# EAGLE schematic LockBox_ver1 (EAGLE 7.7.0)
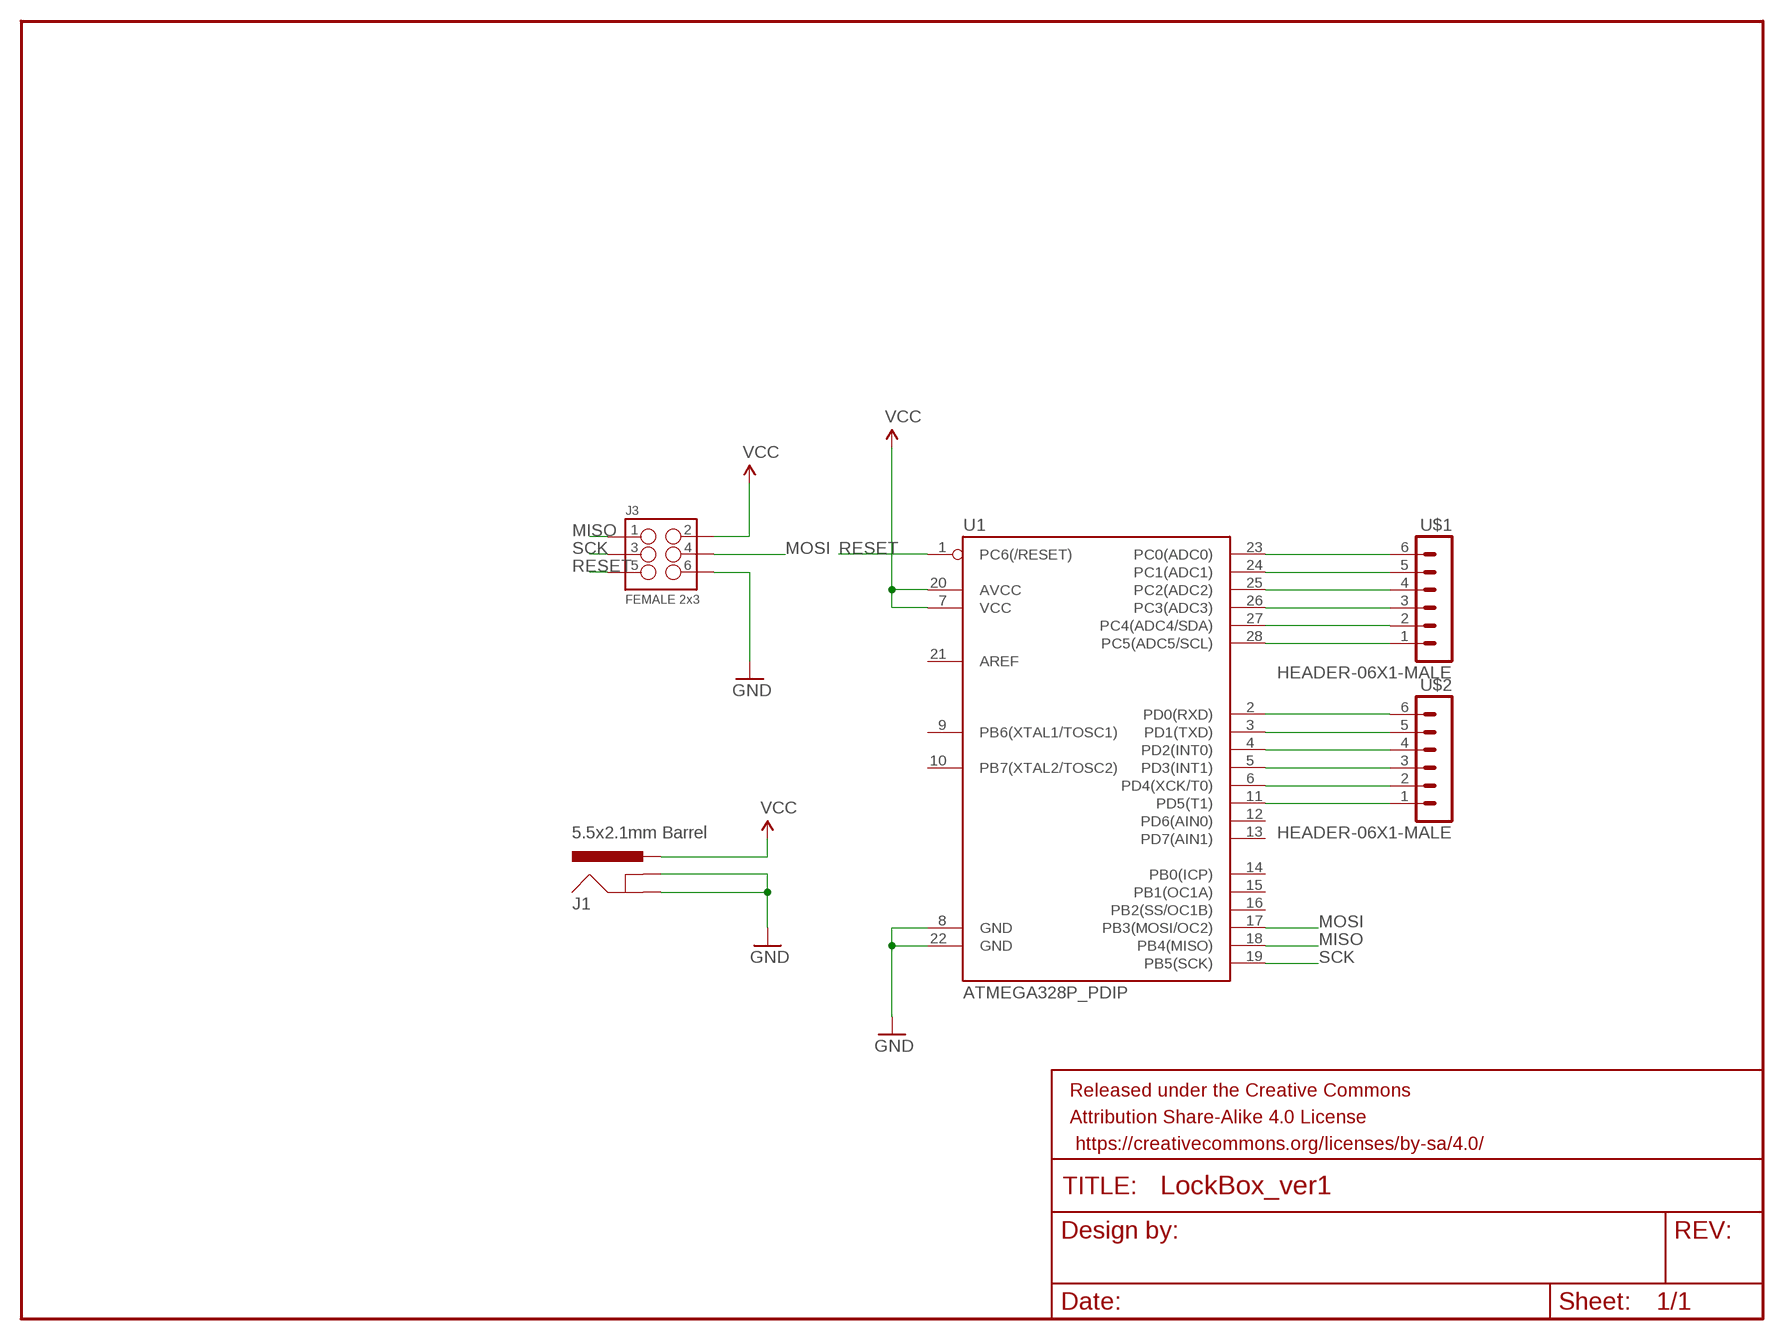
[diagram p0: schematic, sheet 1]

## Parts
FRAME1  FRAME-LETTER  [CREATIVE_COMMONS]
J1  5.5x2.1mm Barrel  POWER_JACKSMD  [POWER_JACK_SMD]
J3  FEMALE 2x3  M03X2FEMALE  [2X3]
U1  ATMEGA328P_PDIP  [DIL28-3]
U$1  HEADER-06X1-MALE  [06X1-PTH]
U$2  HEADER-06X1-MALE  [06X1-PTH]

## Nets
GND: J1.GND(GNDBREAK) J1.P$4(GND) J3.6 U1.8(GND) U1.22(GND)
MISO: J3.1 U1.18(PB4(MISO))
MOSI: J3.4 U1.17(PB3(MOSI/OC2))
N$1: U1.23(PC0(ADC0)) U$1.6
N$2: U1.24(PC1(ADC1)) U$1.5
N$3: U1.25(PC2(ADC2)) U$1.4
N$4: U1.26(PC3(ADC3)) U$1.3
N$5: U1.27(PC4(ADC4/SDA)) U$1.2
N$6: U1.28(PC5(ADC5/SCL)) U$1.1
N$7: U1.2(PD0(RXD)) U$2.6
N$8: U1.3(PD1(TXD)) U$2.5
N$9: U1.4(PD2(INT0)) U$2.4
N$10: U1.5(PD3(INT1)) U$2.3
N$11: U1.6(PD4(XCK/T0)) U$2.2
N$12: U1.11(PD5(T1)) U$2.1
RESET: J3.5 U1.1(PC6(/RESET))
SCK: J3.3 U1.19(PB5(SCK))
VCC: J1.VIN0(PWR) J3.2 U1.7(VCC) U1.20(AVCC)
Unconnected: U1.9(PB6(XTAL1/TOSC1)) U1.10(PB7(XTAL2/TOSC2)) U1.12(PD6(AIN0)) U1.13(PD7(AIN1)) U1.14(PB0(ICP)) U1.15(PB1(OC1A)) U1.16(PB2(SS/OC1B)) U1.21(AREF)

## Library data of the parts
FRAME1 = SparkFun-Aesthetics:FRAME-LETTER: Schematic Frame Standard 8.5x11 US Letter frame
J1 = SparkFun-Connectors:POWER_JACK: Power Jack This is the standard 5.5mm barrel jack for power. The PTH is the most common, proven, reliable, footprint. The Slot footprint only works if the mill layer is transmitted to the PCB fab house so be warned. Mating wall wart : TOL-00298 (and others); PROD_ID: CONN-08106; SF_ID: PRT-12748
J3 = SparkFun-Connectors:M03X2: 2x3 .1" header. Shrouded, with keying- CONN-10681 SMT- CONN-11415 Pogo pins- HW-11044; PROD_ID: CONN-11566
U1 = SparkFun-DigitalIC:ATMEGA328P_PDIP: uC used in the Arduino 32kb flash, 1k EEPROM, 2k SRAM This is the through-hole version of this chip.
U$1 U$2 = GeekAmmo:HEADER-06X1?: 6 x 0.1 inch Header 40x1 0.1inch Male Breakaway header can be used. - 4UCON 00834 <http://www.4uconnector.com/online/SearchPro.asp?FormName=ProSearch&FormAction=search&s_GroupNo=&s_keyword=00834> For female part, if possible use 6 x 1 without breaking.; OTHER: 4UCON 00834; URL: http://www.4uconnector.com/online/SearchPro.asp?FormName=ProSearch&FormAction=search&s_GroupNo=&s_keyword=00834